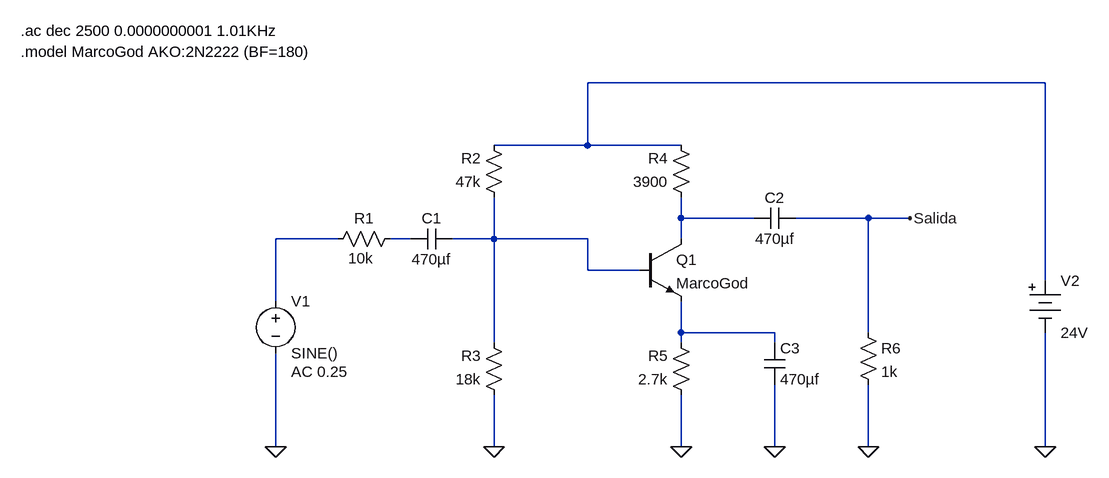
[diagram p0: schematic Modelo transistor.asc]
Modelo transistor.asc, the LTspice schematic file:
Version 4
SHEET 1 1288 680
WIRE 1216 -288 512 -288
WIRE 512 -192 512 -288
WIRE 512 -192 368 -192
WIRE 656 -192 512 -192
WIRE 656 -80 656 -112
WIRE 768 -80 656 -80
WIRE 944 -80 832 -80
WIRE 1008 -80 944 -80
WIRE 128 -48 32 -48
WIRE 240 -48 208 -48
WIRE 368 -48 368 -112
WIRE 368 -48 304 -48
WIRE 512 -48 368 -48
WIRE 656 -48 656 -80
WIRE 512 0 512 -48
WIRE 592 0 512 0
WIRE 1216 16 1216 -288
WIRE 32 48 32 -48
WIRE 656 96 656 48
WIRE 800 96 656 96
WIRE 944 96 944 -80
WIRE 368 112 368 -48
WIRE 656 112 656 96
WIRE 800 112 800 96
WIRE 32 272 32 128
WIRE 368 272 368 192
WIRE 656 272 656 192
WIRE 800 272 800 176
WIRE 944 272 944 176
WIRE 1216 272 1216 96
FLAG 32 272 0
FLAG 368 272 0
FLAG 656 272 0
FLAG 800 272 0
FLAG 944 272 0
FLAG 1216 272 0
FLAG 1008 -80 Salida
SYMBOL voltage 32 32 R0
WINDOW 123 24 124 Left 2
WINDOW 39 0 0 Left 0
SYMATTR Value2 AC 0.25
SYMATTR InstName V1
SYMATTR Value SINE()
SYMBOL res 224 -64 R90
WINDOW 0 0 56 VBottom 2
WINDOW 3 46 80 VLeft 2
SYMATTR InstName R1
SYMATTR Value 10k
SYMBOL res 384 -96 R180
WINDOW 0 36 76 Left 2
WINDOW 3 36 40 Left 2
SYMATTR InstName R2
SYMATTR Value 47k
SYMBOL res 384 208 R180
WINDOW 0 36 76 Left 2
WINDOW 3 36 40 Left 2
SYMATTR InstName R3
SYMATTR Value 18k
SYMBOL res 672 -96 R180
WINDOW 0 36 76 Left 2
WINDOW 3 36 40 Left 2
SYMATTR InstName R4
SYMATTR Value 3900
SYMBOL res 672 208 R180
WINDOW 0 36 76 Left 2
WINDOW 3 36 40 Left 2
SYMATTR InstName R5
SYMATTR Value 2.7k
SYMBOL npn 592 -48 R0
SYMATTR InstName Q1
SYMATTR Value MarcoGod
SYMBOL cap 304 -64 R90
WINDOW 0 0 32 VBottom 2
WINDOW 3 32 32 VTop 2
SYMATTR InstName C1
SYMATTR Value 470µf
SYMBOL cap 832 -96 R90
WINDOW 0 0 32 VBottom 2
WINDOW 3 32 32 VTop 2
SYMATTR InstName C2
SYMATTR Value 470µf
SYMBOL res 928 80 R0
SYMATTR InstName R6
SYMATTR Value 1k
SYMBOL Misc\\battery 1216 0 R0
WINDOW 123 0 0 Left 0
WINDOW 39 0 0 Left 0
SYMATTR InstName V2
SYMATTR Value 24V
SYMBOL cap 784 112 R0
SYMATTR InstName C3
SYMATTR Value 470µf
TEXT -360 -368 Left 2 !.ac dec 2500 0.0000000001 1.01KHz
TEXT -360 -336 Left 2 !.model MarcoGod AKO:2N2222 (BF=180)

The netlist it stands for:
* Modelo transistor.asc
V1 N003 0 SINE() AC 0.25
R1 N004 N003 10k
R2 N005 N001 47k
R3 0 N005 18k
R4 N002 N001 3900
R5 0 N006 2.7k
Q1 N002 N005 N006 0 MarcoGod
C1 N005 N004 470µf
C2 Salida N002 470µf
R6 Salida 0 1k
V2 N001 0 24V
C3 N006 0 470µf
.model NPN NPN
.model PNP PNP
.lib standard.bjt
.ac dec 2500 0.0000000001 1.01KHz
.model MarcoGod AKO:2N2222 (BF=180)
.backanno
.end